# EAGLE board 519_jetson_nano1014 (EAGLE 9.6.0)
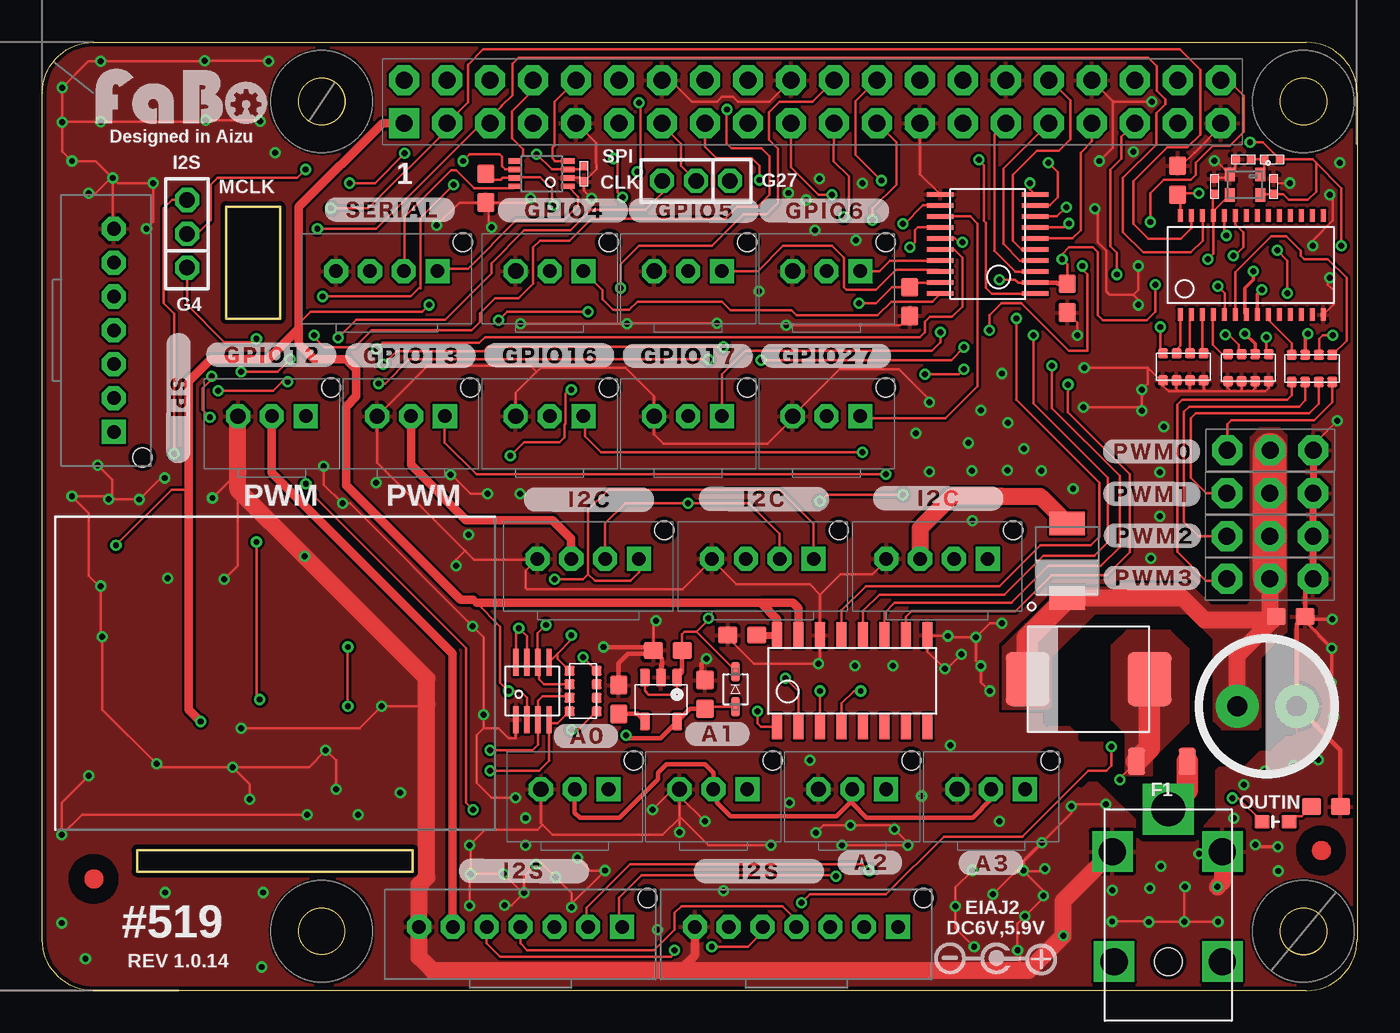
[diagram p2: board, top side]
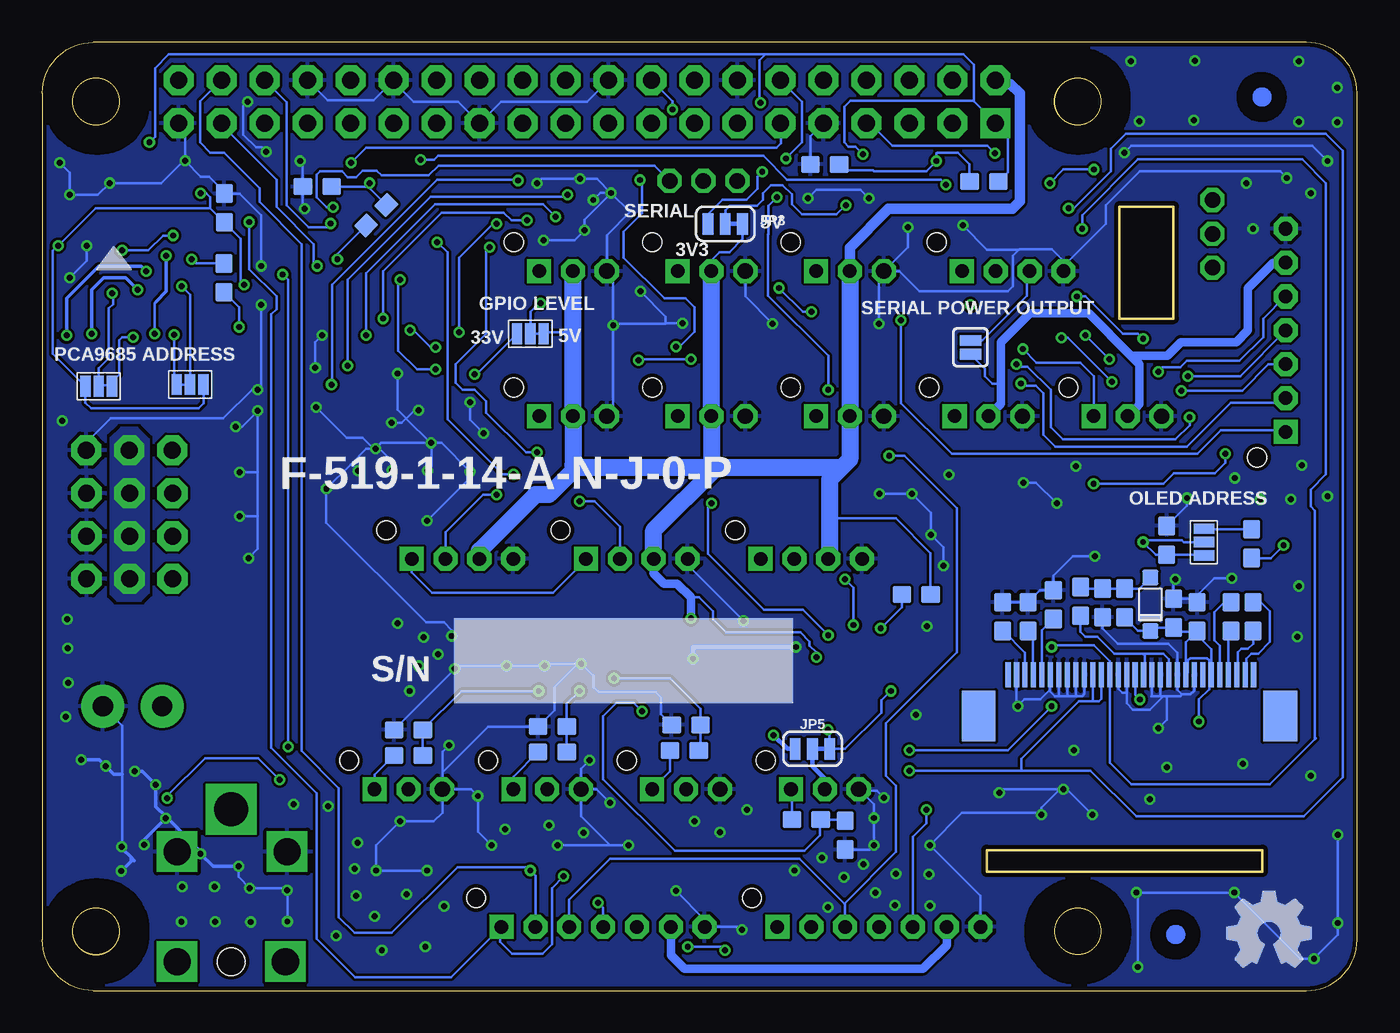
[diagram p3: board, bottom side, seen from below]

Size 77.68 x 56 mm. Coordinates in mm from the lower left corner, seen from the top.
Outline: 5.6,7.03 21.88,7.03 21.88,8.3 5.6,8.3 5.6,7.03
Outline: 10.85,46.29 14.05,46.29 14.05,39.69 10.85,39.69 10.85,46.29
Outline: circle at 16.51,52.51 radius 1.38
Outline: circle at 74.5,52.5 radius 1.38
Outline: circle at 16.5,3.5 radius 1.38
Outline: circle at 74.5,3.49 radius 1.38
Copper layers (1*16): Top 0.035mm / dielectric 1.6mm / Bottom 0.035mm
Design rules "PCBway": minimum track width 6mil, minimum drill 12mil, track to track 6mil, track to pad 6mil, pad to pad 6mil, via to via 6mil, smd to smd 6mil, copper to edge 10mil, drill to drill 10mil, minimum pad ring 10mil, minimum via ring 6mil, stop-mask expansion 2mil, vias tented up to drill 100mil, thermal gap 8mil
tKeepout: area 1,9.7 to 26.4,27.6
bKeepout: area 3.5,7.7 to 24.2,20; area 68.5,45.3 to 72.3,48.9
tRestrict: area 13.5,49.5 to 19.5,55.5; area 71.5,49.5 to 77.5,55.5; area 71.5,0.5 to 77.4,6.5; area 13.5,0.5 to 19.5,6.5; 135 lines
bRestrict: area 13.5,49.5 to 19.5,55.5; area 71.5,49.5 to 77.5,55.5; area 13.5,0.5 to 19.5,6.5; area 71.5,0.5 to 77.5,6.5; 8 lines

## Footprints (pad centres in the part's own frame; a part is rotated, then mirrored left to right if it is on the bottom)
FABO_BRICK_3PIN_B03B-PASK-1 = drill 0.9 pad 1.422 octagon: GND -2,0 | drill 0.8 pad 1.422 square: I/O 2,0 | drill 0.8 pad 1.422 octagon: VCC 0,0 | hole 1.1: 3.5,1.7
0603 = smd 1.1 x 1: 1 -0.85,0; 2 0.85,0
0402 = smd 0.5 x 0.5: P$1 -0.46,0; P$2 0.46,0
E7(PANA) = drill 1.2 pad 2.54: MINUS 1.75,0; PLUS -1.75,0
1N4148W = smd 0.9 x 0.95: ANODE 0,0; CATHODE 3.15,0
SOD-323 = smd 1.14 x 0.52: A 1.04,0; C -1.04,0
1206 = smd 1 x 1.6: 1 -1.5,0; 2 1.5,0
FABO_BRICK_I2C_B04B-PASK-1 = drill 0.8 pad 1.422 octagon: GND -3,0; SDA 1,0; VCC -1,0 | drill 0.8 pad 1.422 square: SCL 3,0 | hole 1.1: 4.5,1.7
SPI-B07B-PASK-1 = drill 0.8 pad 1.422 octagon: 1 -6,1.27; 2 -4,1.27; 3 -2,1.27; 4 0,1.27; 5 2,1.27; 6 4,1.27 | drill 0.8 pad 1.422 square: 7 6,1.27 | hole 1.1: 7.5,2.97
8PIN-SSOP = smd 0.3 x 1.6: 1 -0.975,-1.7; 2 -0.325,-1.7; 3 0.325,-1.7; 4 0.975,-1.7; 5 0.975,1.7; 6 0.325,1.7; 7 -0.325,1.7; 8 -0.975,1.7
MICROCHIP-MCP3008 = smd 0.6 x 1.5: 1 -4.445,-2.7; 2 -3.175,-2.7; 3 -1.905,-2.7; 4 -0.635,-2.7; 5 0.635,-2.7; 6 1.905,-2.7; 7 3.175,-2.7; 8 4.445,-2.7; 9 4.445,2.7; 10 3.175,2.7; 11 1.905,2.7; 12 0.635,2.7; 13 -0.635,2.7; 14 -1.905,2.7; 15 -3.175,2.7; 16 -4.445,2.7
JUMPERS_JP2-2MM = drill 0.914 octagon: 1 -2,0; 2 0,0; 3 2,0
SMT-JUMPER_2_NC_PASTE_SILK = smd 0.635 x 1.27: 1 -0.406,0; 2 0.406,0
SMT-JUMPER_3_1-NC_TRACE_SILK = smd 0.635 x 1.27: 1 -1.016,0; 2 0,0; 3 1.016,0
0603' = smd 0.9 x 0.8: ANODE -0.8,0; CATHODE 0.8,0
M04339A0 = drill 1.6 square: GND -3.2,-6.5; GNDBREAK 3.3,-6.5; ND1 -3.2,0; ND2 3.2,0 | drill 2 square: VCC 0,-9 | hole 1.6: 0,0
FABO_BRICK_3PIN_HEADER = drill 1 pad 1.778 octagon: GND -2.54,0; I/O 2.54,0; VCC 0,0
EXBV8V = smd 0.6 x 0.6: 1 -1.2,-0.8; 2 -0.4,-0.8; 3 0.4,-0.8; 4 1.2,-0.8; 5 1.2,0.8; 6 0.4,0.8; 7 -0.4,0.8; 8 -1.2,0.8
FABO_BRICK_SERIAL_B04B-PASK-1 = drill 0.8 pad 1.422 octagon: GND -3,0; TX 1,0; VCC -1,0 | drill 0.8 pad 1.422 square: RX 3,0 | hole 1.1: 4.5,1.7
SMD-JUMPER-3 = smd 0.61 x 1.219: 1 -0.787,0; 2 0,0; 3 0.787,0
ER-CON30HT-1 = smd 0.3 x 1.5 bottom: 1 7,-0.23; 2 6.5,-0.23; 3 6,-0.23; 4 5.5,-0.23; 5 5,-0.23; 6 4.5,-0.23; 7 4,-0.23; 8 3.5,-0.23; 9 3,-0.23; 10 2.5,-0.23; 11 2,-0.23; 12 1.5,-0.23; 13 1,-0.23; 14 0.5,-0.23; 15 0,-0.23; 16 -0.5,-0.23; 17 -1,-0.23; 18 -1.5,-0.23; 19 -2,-0.23; 20 -2.5,-0.23; 21 -3,-0.23; 22 -3.5,-0.23; 23 -4,-0.23; 24 -4.5,-0.23; 25 -5,-0.23; 26 -5.5,-0.23; 27 -6,-0.23; 28 -6.5,-0.23; 29 -7,-0.23; 30 -7.5,-0.23 | smd 2 x 3 bottom: 31 -9.07,-2.67; 32 8.74,-2.67
R-PUSON-N20 = smd 0.25 x 1.55: 1 -2.925,-2.8; 2 -2.275,-2.8; 3 -1.625,-2.8; 4 -0.975,-2.8; 5 -0.325,-2.8; 6 0.325,-2.8; 7 0.975,-2.8; 8 1.625,-2.8; 9 2.275,-2.8; 10 2.925,-2.8; 11 2.925,2.8; 12 2.275,2.8; 13 1.625,2.8; 14 0.975,2.8; 15 0.325,2.8; 16 -0.325,2.8; 17 -0.975,2.8; 18 -1.625,2.8; 19 -2.275,2.8; 20 -2.925,2.8
SOT-23-5 = smd 0.6 x 1.05: 1 -0.95,-1.3; 2 0,-1.3; 3 0.95,-1.3; 4 0.95,1.3; 5 -0.95,1.3
JETSON_NANO_COMPA = drill 1 pad 1.778 square: 1 -17.78,15.24 | drill 1 pad 1.778 octagon: 2 -17.78,17.78; 3 -15.24,15.24; 4 -15.24,17.78; 5 -12.7,15.24; 6 -12.7,17.78; 7 -10.16,15.24; 8 -10.16,17.78; 9 -7.62,15.24; 10 -7.62,17.78; 11 -5.08,15.24; 12 -5.08,17.78; 13 -2.54,15.24; 14 -2.54,17.78; 15 0,15.24; 16 0,17.78; 17 2.54,15.24; 18 2.54,17.78; 19 5.08,15.24; 20 5.08,17.78; 21 7.62,15.24; 22 7.62,17.78; 23 10.16,15.24; 24 10.16,17.78; 25 12.7,15.24; 26 12.7,17.78; 27 15.24,15.24; 28 15.24,17.78; 29 17.78,15.24; 30 17.78,17.78; 31 20.32,15.24; 32 20.32,17.78; 33 22.86,15.24; 34 22.86,17.78; 35 25.4,15.24; 36 25.4,17.78; 37 27.94,15.24; 38 27.94,17.78; 39 30.48,15.24; 40 30.48,17.78
VSSOP8 = smd 0.3 x 0.8: 1 -0.75,-1.55; 2 -0.25,-1.55; 3 0.25,-1.55; 4 0.75,-1.55; 5 0.75,1.55; 6 0.25,1.55; 7 -0.25,1.55; 8 -0.75,1.55
PCA9685 = smd 0.3 x 0.75: 1 -4.15,-2.93; 2 -3.5,-2.93; 3 -2.85,-2.93; 4 -2.2,-2.93; 5 -1.55,-2.93; 6 -0.9,-2.93; 7 -0.25,-2.93; 8 0.4,-2.93; 9 1.05,-2.93; 10 1.7,-2.93; 11 2.35,-2.93; 12 3,-2.93; 13 3.65,-2.93; 14 4.3,-2.93; 15 4.3,2.92; 16 3.65,2.92; 17 3,2.92; 18 2.35,2.92; 19 1.7,2.92; 20 1.05,2.92; 21 0.4,2.92; 22 -0.25,2.92; 23 -0.9,2.92; 24 -1.55,2.92; 25 -2.2,2.92; 26 -2.85,2.92; 27 -3.5,2.92; 28 -4.15,2.92
DO-214AB = smd 2.6 x 3.2: ANODE 3.6,0; CATHODE -3.6,0
KC2016Z = smd 0.6 x 0.8: #1 -0.9,-0.6; #2 0.9,-0.6; #3 0.9,0.6; #4 -0.9,0.6
SOD-128 = smd 1.4 x 2.1: A -2.2,0; K 2.2,0

## Placement (x,y rotation side)
A0  [FABO_BRICK_3PIN_B03B-PASK-1]  31.45,11.89 0 top
A1  [FABO_BRICK_3PIN_B03B-PASK-1]  39.65,11.89 0 top
A2  [FABO_BRICK_3PIN_B03B-PASK-1]  47.85,11.89 0 top
A3  [FABO_BRICK_3PIN_B03B-PASK-1]  56.05,11.89 0 top
C1  10uF  [0603]  20.95,22.09 270 bottom
C2  10uF  [0603]  19.45,22.09 270 bottom
C3  10uF  [0603]  15.05,22.89 90 bottom
C4  1uF  [0603]  7.45,22.09 270 bottom
C5  1uF  [0603]  6.15,22.09 90 bottom
C6  1uF  [0603]  9.45,22.09 270 bottom
C7  0.1uF  [0603]  60.55,40.89 270 top
C8  0.1uF  [0603]  67.07,47.86 270 top
C9  0.1uF  [0603]  41.35,20.99 0 top
C10  0.1uF  [0603]  51.25,40.69 270 top
C11  1uF  [0603]  36.95,20.09 0 top
C12  0.1uF  [0603]  73.75,22.09 0 top
C13  0.1uF  [0402]  72.75,47.49 270 top
C14  20pF  [0402]  69.25,47.49 270 top
C15  1uF  [0603]  10.85,22.29 270 bottom
C16  0.01uF  [0603]  34.05,17.19 270 top
C17  4.7uF  [0603]  39.15,17.49 270 top
C18  0.1uF  [0402]  32,48.24 270 top
C19  0.1uF  [0603]  26.2,47.39 270 top
C20  10uF  [0603]  66.93,46.22 90 bottom
C100  OSCON  [E7(PANA)]  72.35,16.79 0 top
D1  1N4148  [1N4148W]  12.22,24.39 270 bottom
D2  1N4148WS  [SOD-323]  40.95,17.79 270 top
F1  1206L150/12SLYR  [1206]  66.14,13.53 180 top
GPIO4  [FABO_BRICK_3PIN_B03B-PASK-1]  29.97,42.49 0 top
GPIO5  [FABO_BRICK_3PIN_B03B-PASK-1]  38.15,42.49 0 top
GPIO6  [FABO_BRICK_3PIN_B03B-PASK-1]  46.33,42.49 0 top
GPIO12  [FABO_BRICK_3PIN_B03B-PASK-1]  13.56,33.92 0 top
GPIO13  [FABO_BRICK_3PIN_B03B-PASK-1]  21.78,33.92 0 top
GPIO16  [FABO_BRICK_3PIN_B03B-PASK-1]  29.97,33.92 0 top
GPIO17  [FABO_BRICK_3PIN_B03B-PASK-1]  38.15,33.92 0 top
GPIO27  [FABO_BRICK_3PIN_B03B-PASK-1]  46.33,33.92 0 top
I2C0  [FABO_BRICK_I2C_B04B-PASK-1]  32.25,25.49 0 top
I2C1  [FABO_BRICK_I2C_B04B-PASK-1]  42.56,25.49 0 top
I2C2  [FABO_BRICK_I2C_B04B-PASK-1]  52.86,25.49 0 top
I2S0  FABO-I2S-7PIN  [SPI-B07B-PASK-1]  28.25,2.49 0 top
I2S1  FABO-I2S-7PIN  [SPI-B07B-PASK-1]  44.55,2.49 0 top
IC1  [8PIN-SSOP]  28.95,17.69 0 top
IC3  [MICROCHIP-MCP3008]  47.85,18.29 0 top
JP1  JUMPERS_JP2-2MM  [JUMPERS_JP2-2MM]  8.55,44.69 90 top
JP2  JUMPER-SMT_2_NC_PASTE_SILK  [SMT-JUMPER_2_NC_PASTE_SILK]  22.85,37.99 270 bottom
JP3  JUMPER-SMT_3_1-NC_TRACE_SILK  [SMT-JUMPER_3_1-NC_TRACE_SILK]  37.33,45.28 0 bottom
JP4  JUMPERS_JP2-2MM  [JUMPERS_JP2-2MM]  38.62,47.82 180 top
JP5  JUMPER-SMT_3_1-NC_TRACE_SILK  [SMT-JUMPER_3_1-NC_TRACE_SILK]  32.18,14.28 0 bottom
LED1  [0603']  72.86,9.97 0 top
LOGO1  [LOGO_FABO_M]  8.23,50.82 0 top
P2  [M04339A0]  66.52,1.71 180 top
PWM0  [FABO_BRICK_3PIN_HEADER]  72.54,31.91 180 top
PWM1  [FABO_BRICK_3PIN_HEADER]  72.53,29.37 180 top
PWM2  [FABO_BRICK_3PIN_HEADER]  72.53,26.83 180 top
PWM3  [FABO_BRICK_3PIN_HEADER]  72.53,24.31 180 top
R1  10k  [EXBV8V]  67.41,36.83 0 top
R2  10k  [EXBV8V]  71.25,36.79 0 top
R3  220  [EXBV8V]  75.01,36.74 180 top
R4  0  [0603]  32.55,10.11 0 bottom
R5  1K  [0603]  75.84,10.87 0 top
R6  4.7K  [0603]  11.25,26.59 270 bottom
R7  0  [0402]  72.65,49.09 0 top
R8  10K  [EXBV8V]  31.95,17.69 270 top
R9  200K  [0603]  26.05,23.39 0 bottom
R10  NC  [0603]  30.25,9.18 90 bottom
R11  0  [0603]  39.75,14.19 0 bottom
R12  0  [0603]  47.55,14.09 0 bottom
R13  0  [0603]  56.05,13.89 0 bottom
R14  NC  [0603]  39.65,15.69 0 bottom
R15  NC  [0603]  47.55,15.59 0 bottom
R16  NC  [0603]  56.05,15.39 0 bottom
R17  20K  [0603]  22.05,47.79 0 bottom
R18  NC  [0603]  66.95,42.09 90 bottom
R19  390K  [0603]  17.95,22.79 270 bottom
R20  4.7K  [0603]  6.25,26.39 270 bottom
R21  1M  [0603]  31.45,48.79 0 bottom
R22  DNP  [0402]  70.95,49.09 0 top
R23  20K  [0603]  57.95,45.79 225 bottom
R24  1M  [0603]  61.44,47.48 0 bottom
R25  100  [0603]  16.35,22.99 90 bottom
R26  10K  [0603]  13.75,22.89 270 bottom
SERIAL  [FABO_BRICK_SERIAL_B04B-PASK-1]  20.35,42.49 0 top
SJ2  [SMD-JUMPER-3]  74.35,35.69 0 bottom
SJ3  [SMD-JUMPER-3]  48.85,38.79 0 bottom
SJ5  [SMD-JUMPER-3]  68.95,35.79 180 bottom
SJ6  [SMD-JUMPER-3]  9.05,26.49 270 bottom
SPI1  FABO-SPI-7PIN  [SPI-B07B-PASK-1]  2.95,38.99 270 top
U1  [ER-CON30HT-1]  13.62,18.88 0 top
U2  TXB0108  [R-PUSON-N20]  55.85,44.09 90 top
U7  LP2985-50  [SOT-23-5]  36.55,17.19 180 top
U$2  JETSON_NANOJETSON_NANO_COMPA  [JETSON_NANO_COMPA]  39.15,35.99 0 top
U$3  [MARK_POINT_3MM]  3.05,6.59 0 top
U$4  [MARK_POINT_3MM]  75.57,8.27 0 top
U$5  [MARK_POINT_3MM]  10.72,3.31 0 bottom
U$6  [MARK_POINT_3MM]  5.62,52.77 0 bottom
U$7  TXB0102  [VSSOP8]  29.5,48.24 90 top
U$8  LOGO_OSHW-M_BOTTOM  [LOGO_OSHW_M_BOTTOM]  5.2,3.4 0 top
U$9  PCA9685  [PCA9685]  71.38,42.85 0 top
U$10  S3D  [DO-214AB]  61.81,18.39 0 top
U$11  KC2016Z  [KC2016Z]  71.05,47.59 180 top
U$12  PMEG10030ELP  [SOD-128]  60.55,25.39 270 top

## Tracks (layer width: path | path; a pad name or v marks a point on that pad's centre or on a via)
3V3  (via drill 0.35)
  Top 0.152: C8.2 67.07,46.94 | v4.35,26.29 7.65,29.59 8.65,29.59 | v22.85,40.49 22.45,40.09 15.85,40.09 15.15,39.39 | R8.6 R8.5 31.66,15.4 v31.27,15.4 | IC1.2 28.65,16.02 28.65,17.29 28.25,17.69 v27.55,17.69 27.05,18.19 27.05,21.49 25.65,22.89 25.45,23.09 | U$11.#4 71.99,47.03 C13.P$2 73.31,47.03 73.65,46.69 74.75,46.69 75.25,47.19 75.25,48.89 | U$9.28 67.22,45.78 67.22,46.86 C8.2 | v71.35,50.09 72.11,50.09 R7.P$2 75.05,49.09 75.25,48.89 | C7.1 60.55,42.89 v60.25,43.19 60.25,43.49 60.65,43.89 62.05,43.89 62.35,43.59 62.35,39.89 62.65,39.59 65.25,39.59 65.75,40.09 v65.75,41.69 | v68.32,47.09 67.16,47.09 C8.2 | 75.25,48.89 76.75,47.39 v76.75,43.99 | C18.P$1 31.79,48.49 U$7.3 30.1,48.49 v29.2,49.39 | 35.3,52.49 v35.25,52.44 35.33,52.36 35.33,48.53 | v52.15,36.39 54.15,36.39 v54.45,36.69 | v56.55,41.99 57.45,41.99 57.65,41.79 58.63,41.79 U2.2 | v35.15,48.35 35.33,48.53 | 35.33,48.53
  Top 0.254: C7.1 60,41.74 59.95,41.79 58.68,41.79 U2.2
  Top 0.406: C9.2 IC3.16
  Top 0.508: U$2.1 20.09,51.23 15.15,46.29 15.15,39.39 15.15,39.09 | 15.15,39.09 15.15,38.19 16.05,37.29 17.95,37.29 18.55,36.69 18.55,35.09 17.95,34.49 17.95,29.84 24.7,23.09 25.45,23.09 | 15.15,39.09 13.35,37.29 9.95,37.29 8.65,35.99 8.65,29.59 8.65,16.59 v9.35,15.89 | 25.65,22.89 42.45,22.89 | 42.45,22.89 43.41,21.94 IC3.16 | IC3.15 44.68,22.57 44.35,22.89 42.45,22.89
  Bottom 0.152: U1.25 8.62,20.16 9.45,20.99 9.45,21.19 | 9.45,21.19 C6.2 10.12,20.57 U1.22 10,18.77 10,19.5 9.87,19.63 8.88,19.63 8.74,19.5 8.74,17.81 9.35,17.2 v9.35,15.89 | 9.45,21.19 10.6,21.19 C15.2 12.02,21.44 D1.CATHODE 12.95,21.24 R26.2 | 34.95,55.29 70.2,55.29 71.02,54.47 71.02,50.42 v71.35,50.09 | 34.95,55.29 23.25,55.29 22.65,54.69 22.65,52.51 | 22.65,52.51 U$2.1 20.65,50.51 20.65,48.34 R17.2 | R20.2 5.1,25.54 v4.35,26.29 | v22.85,40.49 22.95,40.39 | R23.2 60.25,43.49 v60.25,43.19 | v65.75,41.69 65.95,41.89 65.95,42.66 65.96,42.66 65.96,44.4 C20.1 67.77,46.21 | SJ5.1 68.15,35.78 68.15,34.69 68.45,34.39 74.8,34.39 75.14,34.73 SJ2.1 77.05,37.6 77.05,43.69 v76.75,43.99 74.53,46.21 67.77,46.21 | v29.2,49.39 29.65,49.84 30.05,49.84 30.3,50.09 30.3,52.19 29.95,52.54 22.68,52.54 22.65,52.51 | v35.25,52.44 35.3,52.49 35.3,54.94 34.95,55.29 | SJ3.1 52.09,36.33 v52.15,36.39 | v54.45,36.69 55.55,36.69 56.65,37.79 56.65,41.89 v56.55,41.99 | v35.15,48.35 35.44,48.06 35.44,47.35 36.08,46.71 37.49,46.71 38.35,45.85 JP3.1 | v31.27,15.4 31.16,15.29 JP5.3 30.25,14.28 28.12,16.41 28.12,17.15 27.58,17.69 v27.55,17.69 | 67.77,46.21 67.77,46.85 68.01,47.09 v68.32,47.09
5V  (via drill 0.35)
  Top 0.152: U2.19 51.77,41.82 51.5,41.54 C10.1 50.2,41.54 49.25,40.59 v48.25,40.59 | D2.C 40.95,18.89 38.65,21.19 | 38.65,21.19 37.95,21.19 37.8,21.04 C11.2 | R8.7 R8.8 v31.95,19.69 | 38.65,21.19 39.35,21.89 v39.35,21.99 | 56.45,29.49 56.75,29.19 | U7.3 35.6,17.7 35.82,17.48 37.32,17.48 37.5,17.66 U7.1
  Top 0.254: U7.1 37.8,18.79 C11.2
  Top 0.508: I2S0.2 24.25,19.89 13.56,30.58 GPIO12.VCC | GPIO13.VCC 21.78,31.06 25.05,27.79 30.15,27.79 31.25,26.69 I2C0.VCC
  Top 1.016: U$12.A 58.95,29.19 56.75,29.19 53.75,29.19 51.86,27.3 I2C2.VCC
  Bottom 0.152: v31.95,19.69 31.95,19.97 32.35,20.37 32.35,20.61 32.89,21.15 37.28,21.15 38.05,21.92 38.05,22.39 38.88,23.22 39.35,23.22 | R9.2 25.2,25.84 27.25,27.89 31.15,27.89 | 46.6,42.76 GPIO6.VCC | JP2.2 22,36.73 22,36.29 21.55,35.84 21.05,35.84 | v48.25,40.59 48.35,40.59 48.85,40.09 SJ3.2 SJ3.3 47.96,38.89 46.33,38.89 | JP3.3 36.31,44.39 37.09,43.61 37.67,43.61 38.15,43.13 GPIO5.VCC
  Bottom 0.254: 21.16,36.38 21.05,36.49
  Bottom 0.5: 13.06,34.42 GPIO12.VCC | 21.05,34.68 21.05,35.84 21.05,36.49 21.05,38.29 19.35,39.99 15.85,39.99 | v39.35,21.99 39.35,23.22
  Bottom 0.508: 15.85,39.99 13.36,37.5 | 13.36,37.5 12.86,37 12.86,34.62 13.06,34.42 | 13.36,37.5 11.22,37.5 10.43,38.29 7.15,38.29 6.45,38.99 6.45,41.49 4.95,42.99 SPI1.2 | I2S0.2 24.25,2.69 25.65,1.29 39.75,1.29 40.55,2.09 I2S1.2 | 21.05,34.68 21.05,34.65 GPIO13.VCC | 39.35,23.22 40.17,24.04 40.95,24.04 41.56,24.65 I2C1.VCC
  Bottom 0.61: U$2.2 21.13,53.53 20.48,53.53 19.93,52.98 19.93,46.61 20.38,46.16 27.68,46.16 29.97,43.87 GPIO4.VCC
  Bottom 1: I2C0.VCC 31.15,25.59 31.15,27.89 | I2C1.VCC 41.56,27.18 37.86,30.88
  Bottom 1.016: 37.86,30.88 46.16,30.88 | 46.16,30.88 47.75,29.29 48.55,29.29 51.86,25.98 I2C2.VCC | 30.46,30.88 29.97,31.37 GPIO16.VCC GPIO4.VCC 29.9,42.56 | 30.46,30.88 37.86,30.88 | 31.15,27.89 31.15,30.19 30.46,30.88 | 37.86,30.88 38.15,31.17 GPIO17.VCC GPIO5.VCC | 46.16,30.88 46.33,31.05 GPIO27.VCC 46.33,38.89 GPIO6.VCC
+5  (via drill 0.35)
  Top 0.152: C17.2 39.26,16.75 D2.A
  Top 0.254: U7.5 38.25,16.64 C17.2 38.95,16.44 | 37.5,15.84 U7.5 | U7.5 36.52,14.91 34.66,14.91 v34.48,15.09
  Bottom 0.254: v34.48,15.09 33.67,14.28 JP5.1
AVDD
  Top 0.254: A0.VCC 31.45,10.51 31.76,10.2 34.09,10.2 36.38,12.49 36.38,12.87 36.88,13.37 39.15,13.37 39.65,12.87 A1.VCC 39.85,11.69 39.85,11.09 40.65,10.29 46.91,10.29 47.85,11.23 A2.VCC 47.85,11.07 48.7,10.22 54.97,10.22 56.05,11.3 A3.VCC
  Bottom 0.254: JP5.2 32.18,13.25 31.45,12.52 A0.VCC
CH0
  Bottom 0.152: R4.1 33.4,11.84 A0.I/O
CH1
  Bottom 0.152: A1.I/O 40.6,12.94 R11.1
CH2
  Bottom 0.152: R12.1 49.85,12.64 A2.I/O
CH3
  Bottom 0.152: R13.1 58.05,12.74 A3.I/O
GND  (via drill 0.35)
  Top 0.152: R2.1 70.05,35.59 70.25,35.39 | 70.25,35.39 70.75,35.39 | 70.75,35.39 70.85,35.49 R2.2 | R2.3 71.65,35.59 71.45,35.39 | 71.45,35.39 70.75,35.39 | R1.4 68.61,35.53 68.75,35.39 | 68.75,35.39 70.25,35.39 | R1.1 66.21,35.89 | 66.21,35.89 66.21,35.73 66.55,35.39 67.15,35.39 | 67.15,35.39 67.75,35.39 | R1.3 67.81,35.45 67.75,35.39 | R1.2 67.01,35.53 67.15,35.39 | U$9.14 76.28,40.52 76.28,41.36 75.95,41.69 75.95,41.99 v76.05,42.09 | R2.4 72.45,35.59 72.25,35.39 71.45,35.39 | 22.71,16.89 22.61,16.79 v20.05,16.79 18.75,15.49 v11.75,15.49 | v10.75,24.29 11.55,25.09 11.55,29.59 | v10.05,29.09 11.55,30.59 | C11.1 36.1,21.7 v36.25,21.85 | C14.P$1 69.29,47.99 69.95,47.99 U$11.#2 | U$11.#2 70.49,48.53 R22.P$1 | U$2.25 51.85,48.22 U2.11 | U$11.#2 69.34,49 v69.24,49 | C8.1 67.28,48.71 68.06,49.48 68.08,49.48 69.63,51.04 U$2.39 | v62.45,48.99 63.24,49.79 63.24,50.36 63.25,50.36 63.25,52.53 | U$2.34 63.25,52.53 | 29.55,9.79 29.45,9.89 A0.GND 29.5,11.89 | 29.55,9.79 30.15,9.19 36.65,9.19 37.64,10.18 | 37.65,10.29 37.65,10.19 37.64,10.18 | 37.65,10.29 37.65,11.49 | 37.65,11.49 37.65,11.8 | 37.65,11.8 A1.GND | v43.05,8.59 39.35,8.59 37.65,10.29 | v25.25,8.59 25.3,8.64 | 25.3,8.64 26.15,9.49 29.25,9.49 29.55,9.79 | IC3.14 45.95,20.69 | 45.95,20.69 45.95,19.39 45.9,19.34 | 45.9,19.34 v45.85,19.29 42.05,19.29 40.5,20.84 C9.1 | 45.95,23.39 47.15,24.59 49.03,24.59 49.86,25.42 I2C2.GND | 45.95,20.69 45.95,20.7 45.95,23.39 | IC3.9 52.15,20.85 | 46.05,19.19 45.9,19.34 | 45.95,23.39 45.35,23.99 41,23.99 39.56,25.43 | 29.2,25.44 28.55,24.79 28.55,23.79 28.65,23.69 37.82,23.69 39.56,25.43 | 29.2,25.44 I2C0.GND | 29.2,25.44 25.5,25.44 24.97,25.97
  Top 0.152: 24.97,25.97 19.78,31.16 GPIO13.GND 22.72,36.86 22.72,36.89 28.85,36.89 29.2,36.54 | 29.2,36.54 27.97,35.31 GPIO16.GND | 29.2,36.54 29.45,36.79 34.45,36.79 36.15,35.09 GPIO17.GND 36.15,32.84 36.7,32.29 42.85,32.29 44.33,33.77 GPIO27.GND 47.1,36.69 50.6,36.69 52.4,34.89 v52.4,34.74 | v4.15,47.99 4.15,45.06 SPI1.1 | U$2.14 37.11,53.77 38.39,52.49 39.85,52.49 40.15,52.79 40.79,52.79 41.09,52.49 42.95,52.49 U$2.20 | v62.18,46.18 62.35,46.01 62.35,44.19 62.85,43.69 62.85,41.29 63.05,41.09 64.45,41.09 | v64.75,42.79 64.75,41.39 64.45,41.09 | C10.2 50.7,39.29 v43.95,39.29 | v28.25,39.39 v34.55,39.39 v34.56,39.4 v39.87,39.4 | C7.2 61.15,39.44 v61.15,38.69 | v61.55,36.79 65.31,36.79 | 65.31,36.79 66.21,35.89 | 65.31,36.79 65.31,35.85 v64.95,35.49 v64.95,34.24 64.75,34.44 v61.5,34.44 | 64.45,41.09 64.75,40.79 v64.75,40.49 | v73.69,47.69 73.01,47.69 C13.P$1 | v75.05,43.99 75.05,44.29 76.25,45.49 76.25,46.79 v76.05,46.99 | v37.64,9.35 37.64,10.18 | v36.05,10.69 37.16,11.8 37.65,11.8 | v39.15,9.99 37.65,11.49 | v54.95,7.09 53.95,6.09 v53.95,4.99 53.95,3.69 v55.05,2.59 | v56.15,5.69 57.55,7.09 v57.95,7.09 58,7.04 | 58,7.04 59.15,5.89 v59.15,5.59 59.15,5.49 v58.05,4.39 57.62,3.96 v57.62,2.39 57.75,2.26 57.75,1.19 | IC1.1 27.95,15.97 27.95,14.89 27.55,14.89 26.95,15.49 26.05,15.49 | 26.05,15.49 25.66,15.09 25.66,12.29 26.55,11.39 v27.95,11.39 | v17.35,11.89 17.35,13.59 v16.75,14.19 15.75,13.19 v11.25,13.19 | v11.25,13.19 6.95,13.19 v6.75,13.39 3.55,16.59 v3.55,20.89 3.45,20.99 v3.45,23.89 3.35,23.89 2.75,24.49 2.75,28.19 v1.75,29.19 3.74,29.19 v3.92,29.01 4.12,29.01 | v15.65,10.39 2.35,10.39 v1.15,9.19 1.15,11.09 v2.75,12.69
  Top 0.152: 4.1,48.04 3.15,48.99 v1.75,48.99 1.17,49.57 v1.17,51.27 | 4.1,48.04 v4.15,47.99 | v2.75,47.09 3.15,47.09 4.1,48.04 | v4.15,47.99 4.45,47.69 v6.55,47.69 6.55,45.39 v6.15,44.99 | v11.25,13.19 12.25,12.19 v12.25,11.29 | v47.25,8.59 51.02,8.59 | 51.02,8.59 v51.15,8.59 | IC3.9 52.3,20.02 v53.32,19 53.44,19 v54.31,19.87 | IC3.9 52.34,20.94 53.4,20.94 | 53.4,20.94 v53.5,20.94 | v65.54,52.49 63.29,52.49 63.25,52.53 | I2C1.GND 39.56,25.43 | 67.75,35.39 68.75,35.39 | PWM0.GND 75.08,32.22 v76.5,33.64 | U$7.2 31.79,47.99 C18.P$2 | 26.35,46.54 C19.2 24.65,46.54 v23.3,45.19 | 26.35,46.54 28.6,46.54 v28.85,46.79 | v32.45,46.79 32,47.24 C18.P$2 | U$2.9 32.7,50.06 32.7,48.82 32.73,48.8 32.73,48.51 C18.P$2 | v26.55,45.09 26.35,45.29 26.35,46.54 | v25.24,5.01 25.24,6.8 v25.3,6.86 | v25.3,6.86 25.3,8.64 | v25.3,6.86 25.34,6.9 v27.25,6.9 28.38,5.77 v28.45,5.77 | v28.45,5.77 27.71,5.03 v27.31,5.03 | v28.45,5.77 28.45,6.75 v29.17,7.47 29.54,7.47 v30.31,6.7 31.27,5.74 v31.27,4.92 31.27,5.12 v33.24,7.09 32.38,7.09 v31.63,7.84 | v45.71,9.33 46.14,9.76 v47.74,9.76 50.11,9.76 v50.34,9.53 51.02,8.85 51.02,8.59 | v1.17,51.27 v1.17,53.32 v1.18,53.33 2.72,54.87 3.43,54.87 v3.45,54.89 9.57,54.89 v9.6,54.92 13.35,54.92 v13.38,54.89 | 4.12,29.01 v5.71,29.01 v5.72,29 6.99,30.27 v7.22,30.27 | v3.27,31.02 4.12,30.17 4.12,29.01 | v16.63,30.96 16.63,29.88 v17.74,28.77 18.17,28.77 v25.43,21.51 26.08,20.86 v26.08,16.28 26.08,15.52 26.05,15.49 | v24.12,30.47 24.17,30.47 25.31,29.33 v26.3,29.33 | v24.45,25.08 24.45,25.45 24.97,25.97 | v1.17,51.27 1.21,51.31 v3.46,51.31 9.56,51.31 v9.66,51.41 12.81,51.41 v12.87,51.35
  Top 0.152: v59.06,8.74 60.8,10.48 v60.8,10.89 60.91,11 v62.83,11 | v63.2,4.08 65.35,4.08 v65.38,4.05 v67.46,4.05 v67.47,4.06 | v67.47,4.06 67.47,6.08 v67.51,6.12 | v67.47,4.06 v69.46,4.06 | v55.16,20.87 55.16,19.47 v55.46,19.17 55.46,18.2 v55.97,17.69 | v55.16,20.87 55.98,21.69 v56.68,21.69 | v55.16,20.87 53.47,20.87 53.4,20.94 | v59.22,7.2 59.06,7.04 58,7.04
  Top 0.2: v76.22,21.93 74.76,21.93 C12.2 74.6,21.81 v76.19,20.22 76.19,18.23 v76.14,18.18 76.14,16.33 v76.3,16.17 | v71.65,8.61 71.77,8.49 v72.99,8.49 | v57.95,7.09 57.95,7.63 v59.06,8.74 59.2,8.74
  Top 0.254: R5.2 76.69,14.2 C100.MINUS 74.1,21.59 C12.2 74.6,23.84 PWM3.GND | U7.2 36.55,19.19 36.6,19.14 36.6,19.59 C11.1 | C16.1 34.05,19.34 34.6,19.89 35.74,19.89 35.94,20.09 C11.1 | C17.1 38.95,18.54 38.95,19.29 v39.25,19.59 | v33.15,20.29 35.9,20.29 C11.1
  Top 0.406: PWM0.GND PWM1.GND PWM2.GND PWM3.GND
  Top 0.508: I2S1.1 38.55,2.09 37.65,1.19
  Top 1: 37.65,1.19 23.05,1.19 22.25,1.99 I2S0.1 22.25,6.23 22.71,6.69 22.71,16.89 22.71,18.43 v15.5,25.64 11.55,29.59 11.55,30.59 GPIO12.GND
  Top 1.016: 37.65,1.19 57.75,1.19 58.27,1.19 v60.31,3.23 60.31,5.3 P2.GNDBREAK | P2.GND 69.72,6.42 v69.42,6.12
  Bottom 0.152: U1.6 18.15,18.65 18.15,17.89 | 9.55,18.58 U1.23 9.62,17.72 9.85,17.49 10.35,17.49 | 10.35,17.49 10.62,17.76 U1.21 10.62,19.96 11.15,20.49 14.15,20.49 15.05,21.39 C3.1 | U1.15 13.62,17.56 | 13.62,17.56 13.62,16.96 13.25,16.59 12.25,16.59 11.45,17.39 | 11.55,17.39 12.15,17.39 12.12,17.42 U1.18 | 11.55,17.39 11.45,17.39 | 11.45,17.39 11.25,17.39 | 11.25,17.39 10.45,17.39 10.35,17.49 | U1.19 11.62,17.46 11.55,17.39 | 13.62,17.56 13.66,17.6 13.89,17.6 14.12,17.83 U1.14 | C1.1 C2.1 18.75,23.64 R19.1 17.95,24.49 16.8,25.64 v15.5,25.64 | 9.65,23.14 C15.1 10.85,24.19 v10.75,24.29 | 9.65,23.14 C6.1 | U1.2 20.12,16.86 v20.05,16.79 19.65,17.19 18.72,17.19 18.16,17.75 18.16,17.88 18.15,17.89 | v11.75,15.49 11.25,15.99 11.25,17.39 | R6.1 10.05,28.64 v10.05,29.09 | v69.24,49 69.24,50.84 U$2.39 | v62.45,48.99 62.29,48.83 R24.1 62.29,46.33 62.18,46.22 v62.18,46.18 | U$2.34 60.83,52.59 58.11,52.59 U$2.30 56.93,53.67 55.75,52.49 53.11,52.49 U$2.25 50.59,52.49 45.51,52.49 U$2.20 | v69.24,49 69.29,49.05 70.65,47.69 v73.69,47.69 74.39,46.99 v76.05,46.99 76.05,48.31 v76.64,48.9 | v64.75,42.79 64.75,45.79 66.03,47.07 66.84,47.07 | A2.GND 45.85,10.29 44.15,8.59 | 44.15,8.59 v43.05,8.59 | I2S0.1 22.25,5.59 v25.25,8.59 23.35,10.49 18.75,10.49 v18.65,10.39 18.65,10.79 17.55,11.89 | C100.MINUS 72.95,15.64 72.95,12.77 72.95,8.49 72.95,8.37 | GPIO4.GND 27.05,42.49 25.85,41.29 20.65,41.29 20.35,41.59 20.35,43.39 19.98,43.77 | 19.98,43.77 19.95,43.79 18.05,43.79 17.35,43.09 SERIAL.GND 17.35,42.79 14.85,45.29 14.85,46.39 12.85,48.39 4.55,48.39 v4.15,47.99 | v61.15,38.69 61.55,38.29 v61.55,36.79
  Bottom 0.152: PWM0.GND 75.08,32.36 73.65,33.79 66.99,33.79 65.29,35.49 v64.95,35.49 64.75,35.69 v64.75,40.49 | v76.05,42.09 75.05,43.09 v75.05,43.99 | R14.1 41.12,16.31 41.12,17.29 41.47,17.64 44.83,17.64 45.11,17.93 45.11,18.58 45.82,19.29 v45.85,19.29 | v45.85,19.29 46.05,19.29 47.42,17.92 47.42,16.57 R15.1 51.33,15.59 54.03,12.9 | R16.1 53.32,18.97 | 53.32,18.97 v53.32,19 | v44.15,11.09 44.95,11.89 A2.GND | v45.35,13.59 45.85,13.09 A2.GND | R10.1 28.81,8.33 v28.55,8.59 v28.55,10.19 28.55,10.99 29.37,11.81 | 29.37,11.81 A0.GND | v27.95,11.39 28.37,11.81 29.37,11.81 | v40.25,5.89 38.55,4.19 I2S1.1 36.52,3.76 v36.35,3.59 | v54.95,7.09 v57.95,7.09 57.95,8.59 v56.55,9.99 54.55,9.99 54.03,10.51 54.03,12.9 | U1.10 16.12,17.53 16.25,17.4 16.55,17.4 | 16.55,17.4 17.05,17.4 | 17.05,17.4 17.65,17.4 | 17.65,17.4 17.86,17.4 18.15,17.69 18.15,17.89 | U1.9 16.62,17.47 16.55,17.4 | U1.8 17.12,17.47 17.05,17.4 | U1.7 17.62,17.43 17.65,17.4 | v15.65,10.39 17.15,11.89 v17.35,11.89 17.55,11.89 | 17.55,11.89 20.95,11.89 v21.15,11.69 | v1.15,9.19 v1.15,3.99 1.15,3.29 v2.55,1.89 3.35,1.89 v7.25,5.79 v13.05,5.79 12.95,5.69 v12.95,1.39 | v1.75,48.99 2.65,49.89 13.35,49.89 v13.75,49.49 | v44.07,47.1 45.65,45.52 v45.65,44.89 46.23,44.31 v48.07,44.31 | 54.03,12.9 54.03,14.11 v53.65,14.49 | v51.15,8.59 51.95,9.39 v51.95,11.49 52.35,11.89 A3.GND | v47.25,8.59 44.15,8.59 | v45.85,19.29 47.9,19.29 v48,19.19 v50.25,19.19 53.1,19.19 53.32,18.97 | v54.95,27.74 52.4,30.29 v52.4,30.64 54.1,32.34 54.68,32.34 | 54.68,32.34 v54.7,32.34 54.75,32.34 | 54.75,32.34 57.65,32.34 57.88,32.12 | 57.88,32.12 v58,31.99 | v58,31.99 58.55,31.99 59.48,31.06
  Bottom 0.152: 59.48,31.06 v60.9,29.64 60.9,27.64 55,21.74 53.95,21.74 53.5,21.29 v53.5,20.94 | v64.45,49.54 64.7,49.79 65.05,49.79 65.8,50.54 65.8,52.23 v65.54,52.49 | GPIO4.GND 28.25,42.21 v28.25,39.39 | GPIO5.GND 36.15,40.99 v34.55,39.39 | v43.95,39.29 43.95,42.11 GPIO6.GND 44.33,44.61 42.95,45.98 v44.07,47.1 | v36.25,21.85 39.56,25.16 I2C1.GND | v65.5,25.54 64.95,26.09 64.95,28.03 | 64.95,28.03 64.95,30.7 | 64.95,30.7 64.95,34.21 | 64.95,34.21 v64.95,34.24 | v61.5,34.44 59.7,32.64 58.75,32.64 58.1,31.99 v58,31.99 | v7.4,24.34 8.45,24.34 9.65,23.14 | U$2.9 32.3,50.46 R21.1 | v28.85,46.79 29.35,47.29 31.95,47.29 v32.45,46.79 | GPIO4.GND 26.55,43.91 v26.55,45.09 | v23.3,45.19 21.88,43.77 19.98,43.77 | GPIO27.GND 43.95,34.3 v43.95,39.29 | v39.87,39.4 40.85,39.4 | v43.95,39.29 43.85,39.39 40.85,39.39 40.85,39.4 | v42.35,41.29 40.85,39.79 40.85,39.4 | v56.7,36.44 56.7,34.29 56.2,33.79 | 56.2,33.79 56.19,33.77 | 56.19,33.77 54.75,32.34 | v17.74,28.77 18.97,30 v19.71,30 | v24.45,25.08 24.45,26.18 v25.18,26.91 25.18,28.21 v26.3,29.33 v28.22,29.33 | v44.07,47.1 44.09,47.12 44.7,47.12 v45.13,46.69 | v44.07,47.1 44.91,47.94 v45.92,47.94 48.2,47.94 v48.46,47.68 | v55.46,34.26 55.7,34.26 56.19,33.77 | v57.04,33.54 56.44,33.54 56.2,33.79 | v54.92,30.71 54.68,30.95 54.68,32.34 | v57.02,30.74 57.02,31.26 57.88,32.12 | v59.02,30.71 59.37,31.06 59.48,31.06 | v66.02,28.02 64.96,28.02 64.95,28.03 | v66.01,30.6 65.05,30.6 64.95,30.7 | v66.26,33.3 65.86,33.3 64.95,34.21 | 66.84,47.07 C20.2 | v69.24,49 68.32,48.07 67.83,48.07 66.84,47.08 66.84,47.07 | v63.2,4.08 v63.2,5.92 v63.21,5.93 63.32,6.04 v65.42,6.04 66.09,6.71 v66.09,7.34
  Bottom 0.152: v51.61,32.91 52.4,33.7 v52.4,34.74
  Bottom 0.2: 72.95,8.37 72.44,7.86 | 72.44,7.86 72.24,7.66 | v66.09,7.34 67.6,7.34 v68.34,8.08 68.34,8.24 70.21,10.11 70.45,10.11 | 70.45,10.11 v70.39,10.17 70.39,10.29 70.97,10.87 v70.97,12.15 71.78,12.96 v72.22,12.96 | 70.45,10.11 71.65,8.91 v71.65,8.61 | v73.01,7.06 72.44,7.63 72.44,7.86 | v72.99,8.49 72.95,8.49 | v75.37,13.64 74.32,13.64 v73.94,13.26 73.45,12.77 72.95,12.77
  Bottom 0.254: v39.25,19.59 39.25,20.29 v33.15,20.29
  pour Bottom (isolate 0.1, rank 5): -0.15,-0.88 78.59,-0.88 78.59,56.34 -0.15,56.34
  pour Top (isolate 0.1, rank 5): -0.15,-1.08 78.49,-1.08 78.49,56.34 -0.15,56.34
GPIO4  (via drill 0.35)
  Top 0.152: v18.15,47.69 19.65,47.69 v21.4,49.44 | JP1.2 9.15,44.69 9.95,45.49 9.95,47.59 10.35,47.99 15.05,47.99 v15.55,48.49
  Bottom 0.152: v15.55,48.49 17.35,48.49 v18.15,47.69 | U$2.7 28.79,51.23 27.45,49.89 21.85,49.89 v21.4,49.44
GPIO5
  Top 0.152: U2.3 57.48,42.47 56.25,43.69 56.25,50.55 U$2.29
GPIO6
  Top 0.152: U2.4 57.76,43.12 56.77,44.11 56.77,48.53 U$2.31
GPIO12
  Top 0.152: U2.5 57.88,43.77 57.35,44.29 57.35,48.19 58.75,49.59 60.05,49.59 60.75,50.29 60.75,52.59 59.57,53.77 U$2.32
GPIO13
  Top 0.152: U2.6 60.85,44.41 61.35,44.91 61.35,49.49 62.01,50.15 U$2.33
GPIO16/UART1_CTS  (via drill 0.35)
  Top 0.152: U2.7 58.68,45.09 60.35,45.09 60.56,45.3 v60.64,45.3
  Bottom 0.152: U$2.36 63.25,52.47 63.25,46.39 61.95,45.09 60.85,45.09 v60.64,45.3
GPIO17/UART1_RTS  (via drill 0.35)
  Top 0.152: U2.9 58.68,46.39 59.53,46.39 60,46.86 60,48.32 v59.44,48.88 v59.44,48.89
  Bottom 0.152: v59.44,48.89 58.55,49.78 34.31,49.78 34.05,50.04 34.05,51.21 U$2.11
GPIO22  (via drill 0.35)
  Top 0.152: v10,36.29 10,36.11 9.47,35.58 9.47,34.29 v9.9,33.86 | v20.14,36.99 20.92,37.77 26.07,37.77 26.31,38.01 v40.24,38.01 | U$2.15 39.15,49.83 39.84,49.15 41.91,49.15 42.36,48.7 v42.36,47.87
  Bottom 0.152: v10,36.29 6.92,36.29 SPI1.4 | v9.9,33.86 9.9,33.38 10.73,32.55 17.4,32.55 18.11,33.26 18.11,35.48 19.48,36.85 20,36.85 v20.14,36.99 | v40.24,38.01 40.04,38.01 39.15,38.9 39.15,40.35 39.68,40.88 40.92,40.88 43.33,43.29 43.33,44.82 42.25,45.9 42.25,47.76 v42.36,47.87
GPIO24/SPI1_CS0  (via drill 0.35)
  Top 0.152: v16.05,38.69 16.05,38.59 16.65,37.99 18.45,37.99 19.45,38.99 25.35,38.99 25.85,39.49 25.85,39.99 26.75,40.89 28.15,40.89 29,41.74 29,43.89 29.4,44.29 31.15,44.29 32.45,45.59 40.32,45.59 41.03,46.3 42.26,46.3 42.97,47.01 42.97,49.27 42.5,49.74 40.72,49.74 40.43,50.03 40.43,52.01 v40.45,52.03 40.48,52 | v14.65,37.29 13.92,36.56 v11.75,36.56
  Bottom 0.152: U$2.18 40.45,52.53 v40.45,52.03 | v16.05,38.69 v14.65,37.29 | v11.75,36.56 11.5,36.81 10.45,36.81 10.07,37.19 6.95,37.19 5.55,38.59 5.55,39.69 4.25,40.99 SPI1.3
GPIO25/SPI1_MISO  (via drill 0.35)
  Top 0.152: U$2.22 45.49,52.49 43.55,52.49 42.93,51.87 42.93,50.25 43.46,49.72 43.46,46.54 42.77,45.85 41.41,45.85 39.55,43.99 35.25,43.99 34.15,42.89 v34.15,41.49 | v32.25,40.09 27.45,40.09 v26.95,39.59
  Bottom 0.152: v26.95,39.59 26.95,34.69 23.95,31.69 9.45,31.69 8.05,33.09 4.32,33.09 SPI1.7 | v34.15,41.49 32.75,40.09 v32.25,40.09
GPIO26/SPI1_MOSI  (via drill 0.35)
  Top 0.152: v61.45,42.79 61.45,42.59 61.75,42.29 61.75,37.79 60.65,37.79 57.85,40.59 56.65,40.59 55.95,39.89 v55.95,38.99 | 42.51,37.29 v42.45,37.23 53.69,37.23 v54.45,37.99 | v39.35,37.29 21.68,37.29 20.24,35.85 v19.87,35.85
  Bottom 0.152: U$2.37 67.09,51.13 63.85,47.89 63.85,46.29 61.65,44.09 61.65,42.99 v61.45,42.79 | v55.95,38.99 55.75,38.99 54.75,37.99 v54.45,37.99 | v42.45,37.23 42.39,37.29 v39.35,37.29 | SPI1.6 4.5,34.71 7.48,34.71 10.07,32.12 17.84,32.12 18.54,32.82 18.54,35.29 18.97,35.72 19.74,35.72 v19.87,35.85
GPIO27  (via drill 0.35)
  Top 0.152: v60.49,46.26 59.94,45.72 U2.8
  Bottom 0.152: JP4.1 41.52,48.72 54.28,48.72 54.86,48.14 57.64,48.14 57.93,48.43 58.75,48.43 59.14,48.04 59.64,48.04 59.98,48.38 61.27,48.38 61.48,48.17 61.48,46.87 60.89,46.27 v60.5,46.27 v60.49,46.26
GPIO27/SPI1_SCK
  Top 0.152: U$2.13 36.57,51.19 37.73,50.02 37.73,48.71 JP4.2
H_SCL  (via drill 0.35)
  Top 0.152: I2C0.SCL 35.25,24.69 34.75,24.19 32.65,24.19 32.25,24.59 | I2C1.SCL 45.56,27.58 43.55,29.59 33.45,29.59 32.25,28.39 32.25,24.59 | v29.75,21.59 29.25,21.09 29.25,19.42 IC1.6 29.35,19.32 29.35,18.39 29.65,18.09 R8.2 | v30.25,24.29 31.95,24.29 32.25,24.59
  Bottom 0.152: v29.75,21.59 29.75,23.79 v30.25,24.29 | I2C2.SCL 55.85,24.69 54.65,23.49 47.5,23.49 45.56,25.43 I2C1.SCL
H_SDA  (via drill 0.35)
  Top 0.152: I2C0.SDA 33.25,27.59 34.45,28.79 v38.15,28.79 41.75,28.79 43.56,26.98 I2C1.SDA | IC1.5 30.44,19.9 | 30.44,19.9 31.25,20.72 v31.25,20.99 | R8.1 30.44,19.6 30.44,19.9 | v45.95,28.89 46.35,29.29 v50.85,29.29
  Bottom 0.152: v31.25,20.99 32.75,22.49 35.05,22.49 38.35,25.79 38.35,28.59 v38.15,28.79 | I2C1.SDA 43.56,27.4 45.05,28.89 v45.95,28.89 | v50.85,29.29 51.65,29.29 53.86,27.08 I2C2.SDA
I2S0_DIN  (via drill 0.35)
  Top 0.152: I2S0.6 32.15,3.86 32.15,4.89 34.73,7.48 48.47,7.48 v48.85,7.09
  Bottom 0.152: U$2.38 68.35,52.51 68.35,50.09 67.75,49.49 66.95,49.49 64.85,47.39 64.85,46.59 62.35,44.09 62.35,14.15 60.16,11.96 60.16,4.34 59.22,3.4 57.04,3.4 53.15,7.29 49.05,7.29 v48.85,7.09 48.55,6.79 I2S1.6
I2S0_DOUT  (via drill 0.35)
  Top 0.152: U$2.40 70.07,53.77 70.99,52.85 70.99,50.73 70.15,49.89 69.15,49.89 68.15,48.89 68.15,48.19 67.85,47.89 66.25,47.89 65.45,47.09 v65.45,45.39 | I2S0.7 34.08,3.93 34.08,5.48 35.4,6.8 46.83,6.8 v46.88,6.75
  Bottom 0.152: v65.45,45.39 65.45,42.59 63.85,40.99 63.85,40.25 64.17,39.93 64.17,14.35 61.46,11.64 61.46,3.06 59.19,0.79 53.52,0.79 50.64,3.67 | 50.64,3.67 I2S1.7 | v46.88,6.75 47.58,6.06 47.58,2.72 48.13,2.17 49.94,2.17 50.64,2.88 50.64,3.67
I2S0_FS  (via drill 0.35)
  Top 0.152: v44.85,5.19 45.35,5.69 49.85,5.69 53.25,9.09 57.9,9.09 61.8,12.99 62.85,12.99 63.15,13.29 v63.15,14.39 | v63.47,42.29 63.47,43.59 63.11,43.95 63.11,48.48 63.75,49.12 63.75,50.43 U$2.35 | I2S0.4 28.25,2.79 28.65,2.39 36.15,2.39 37.35,3.59 37.35,4.59 37.75,4.99 43.72,4.99 44.55,4.16 I2S1.4
  Bottom 0.152: I2S1.4 44.55,4.89 v44.85,5.19 | v63.15,14.39 63.15,41.97 v63.47,42.29
I2S0_SCLK  (via drill 0.35)
  Top 0.152: v27.65,31.59 28.45,32.39 30.55,32.39 30.85,32.69 30.85,33.41 30.91,33.47 30.91,35.25 31.15,35.49 v31.25,35.49 | v34.29,46.84 33.98,47.15 33.98,48.91 v33.75,49.14
  Bottom 0.152: I2S0.5 30.25,5.09 30.3,5.14 | 30.3,5.14 32.94,7.78 44.13,7.78 46.55,5.37 I2S1.5 | 30.3,5.14 27.25,8.19 27.25,12.09 27.85,12.69 27.85,15.79 23.65,19.99 23.65,28.49 26.75,31.59 v27.65,31.59 | v33.75,49.14 32.8,50.09 32.8,52.5 U$2.12 | 34.34,46.79 v34.29,46.84 34.79,46.34 34.79,44.66 34.8,44.65 34.8,41.04 31.25,37.49 v31.25,35.49
MCLK  (via drill 0.35)
  Top 0.152: I2S0.3 26.25,2.79 27.05,1.99 37.15,1.99 37.35,2.19 v37.35,2.39 | I2S1.3 42.55,3.46 41.68,2.59 v39.55,2.59 | v25.45,10.69 25.05,11.09 25.05,20.21 16.15,29.11 16.15,29.35 v15.57,29.93 | v7.8,31.71 7.8,39.96 7.18,40.58 7.18,46.19 7.68,46.69 JP1.3
  Bottom 0.152: I2S0.3 26.25,9.09 25.45,9.89 v25.45,10.69 | 8.45,46.79 JP1.3 | v37.35,2.39 37.55,2.59 v39.55,2.59 | v15.56,29.92 v15.57,29.93 11.46,29.93 10.84,30.55 8.42,30.55 7.8,31.17 v7.8,31.71
N$2
  Top 0.152: U$9.6 70.48,42.42 72.6,44.54 73.5,44.54 74.35,43.69 74.35,43.39 74.55,43.19 75.95,43.19 77.05,42.09 77.05,38.38 R3.1
N$3  (via drill 0.35)
  Top 0.152: v76.25,38.69 75.65,38.69 75.45,38.49 75.45,37.58 R3.2
  Top 0.2: R3.2 | v71.55,42.49 71.55,41.99 71.05,41.49 71.05,40.01 U$9.7
  Bottom 0.2: v76.25,38.69 76.25,40.89 74.35,42.79 71.85,42.79 v71.55,42.49
N$4
  Top 0.152: U$9.1 67.23,38.07 67.01,37.85 R1.7
N$5  (via drill 0.35)
  Top 0.2: v74.75,38.79 74.61,38.65 R3.3 | v72.05,41.39 71.78,41.12 U$9.8
  Bottom 0.2: v74.75,38.79 74.75,41.39 74.05,42.09 72.75,42.09 v72.05,41.39
N$6
  Top 0.152: U$9.9 72.45,39.91 72.45,39.59 73.81,38.23 R3.4
  Top 0.2: R3.4 73.7,37.54
N$7  (via drill 0.35)
  Top 0.152: U$9.23 70.48,45.26 70.95,44.79 70.95,43.89 70.45,43.39 v70.35,43.39
  Top 0.2: v71.05,38.79 71.65,38.19 R2.6 | 70.55,45.71 U$9.23
  Bottom 0.152: 70.95,40.69 71.05,40.59 v71.05,38.79
  Bottom 0.2: v70.35,43.39 70.35,41.29 70.95,40.69
N$8  (via drill 0.35)
  Top 0.152: U$9.25 69.15,45.81 69.15,46.93 C14.P$2 | U$11.#3 69.18,46.02 U$9.25 | U$9.25 69.18,43.52 v68.85,43.19
  Bottom 0.152: v68.85,43.19 68.6,42.94 R18.2
N$9
  Top 0.152: 33.88,40.22 33.9,40.19 | 53.55,41.09 53.48,41.16 U2.20 52.58,40.69 50.15,40.69 49.35,39.89 44.55,39.89 44.25,40.19 40.65,40.19 40.15,40.69 35.15,40.69 34.68,40.22 33.88,40.22 | GPIO4.I/O 33.1,41.36 33.1,40.84 33.73,40.22 33.88,40.22
N$10
  Top 0.152: R1.6 67.81,39.85 U$9.2
N$11
  Top 0.152: U$9.3 68.53,37.71 R1.5
N$12
  Top 0.152: U$9.4 69.15,39.89 69.15,38.14 69.7,37.59 R2.8
N$13
  Top 0.152: U$7.1 31.65,46.89 31.65,46.34 30.8,45.49 28,45.49 25.15,42.64 23.5,42.64 SERIAL.RX
N$14
  Bottom 0.152: C4.2 7.62,21.07 U1.27
N$15
  Top 0.152: U2.18 52.95,42.57 50.43,42.57 49.25,41.39 47.5,41.39 47.35,41.54 47.35,43.29 46.65,43.99 43.77,43.99 42.27,42.49 GPIO5.I/O
N$16
  Bottom 0.152: 8.05,18.72 U1.26 8.12,20.36 8.45,20.69 8.45,22.34 7.85,22.94 C4.1
N$17
  Top 0.152: GPIO6.I/O 49.45,42.49 50.08,43.12 U2.17
N$18  (via drill 0.35)
  Top 0.152: U2.16 53.88,43.77 54.35,43.29 54.35,40.39 53.75,39.79 52.45,39.79 52.15,39.49 52.15,38.89 51.85,38.59 26.15,38.59 25.81,38.25 20.11,38.25 v19.75,37.89
  Bottom 0.152: v19.75,37.89 18.95,37.09 16.35,37.09 15.55,36.29 GPIO12.I/O
N$19
  Bottom 0.152: U1.28 7.05,18.72 7.05,19.99 6.85,20.19 6.45,20.19 6.15,20.49 C5.1
N$20  (via drill 0.35)
  Top 0.152: v54.35,44.19 54.15,44.19 53.93,44.41 U2.15 | GPIO13.I/O 23.78,32.36 25.65,30.49 v49.85,30.49
  Bottom 0.152: v49.85,30.49 50.49,30.49 53.75,33.75 53.75,43.59 v54.35,44.19
N$21
  Bottom 0.152: U1.29 6.55,18.72 6.55,19.59 6.25,19.89 5.85,19.89 5.15,20.59 5.15,22.39 5.7,22.94 C5.2
N$22  (via drill 0.35)
  Top 0.152: v51.25,43.89 51.55,44.19 51.55,44.89 51.73,45.07 U2.14 | GPIO16.I/O 32.05,33.84 32.05,32.74 33,31.79 v48.45,31.79
  Bottom 0.152: v48.45,31.79 49.11,31.79 51.45,34.13 51.45,34.79 52.15,35.49 52.85,35.49 53.25,35.89 53.25,36.99 51.45,38.79 51.45,43.69 v51.25,43.89
N$23
  Bottom 0.152: U1.5 18.62,21.27 R19.2
N$24
  Bottom 0.152: C2.2 19.15,20.94 19.15,18.68 U1.4
N$25
  Bottom 0.152: C1.2 20.9,21.24 19.62,19.96 U1.3
N$26
  Bottom 0.152: 11.18,18.6 U1.20 11.12,19.56 11.45,19.89 12.65,19.89 | 16.15,22.14 R25.1 16.35,22.09 16.35,21.74 16.35,21.19 16.05,20.89 15.35,20.89 14.35,19.89 12.65,19.89 | 12.65,19.89 12.55,19.79 12.55,18.72 U1.17
N$27
  Bottom 0.152: D1.ANODE 12.87,23.74 R26.1 C3.2 16.25,23.74 R25.2
N$28  (via drill 0.35)
  Top 0.152: U2.10 58.35,47.32 v58.35,47.69
  Bottom 0.152: R24.2 58.56,47.48 v58.35,47.69 58.35,47.39 R23.1 57.35,46.49
N$29
  Top 0.152: U2.13 54.83,45.72 55.25,45.29 55.25,35.69 53.35,33.79 48.46,33.79 GPIO27.I/O
N$30
  Top 0.152: U$7.8 27.85,47.39 25.5,47.39 24.45,48.44 24.15,48.44 21.4,45.69 21.4,42.54 SERIAL.TX
N$31  (via drill 0.35)
  Top 0.152: v45.95,17.69 IC3.3
  Bottom 0.152: R12.2 R15.2 46.7,16.94 v45.95,17.69
N$32  (via drill 0.35)
  Top 0.152: U2.1 56.09,41.16 55.75,41.5 55.75,45.35 55.63,45.47 55.63,48.75 v55.32,49.06 | v24.3,47.59 22.35,45.64 22.35,41.59 | 22.35,41.59 22.35,41.49 | 22.35,41.59 21.75,40.99 v16.55,40.99 | JP1.1 8.55,40.49 10.75,38.29 12.45,38.29 v12.65,38.49
  Bottom 0.152: v55.32,49.06 54.54,49.06 54.31,49.29 35.08,49.29 33.68,47.89 24.6,47.89 v24.3,47.59 | v12.65,38.49 12.95,38.79 13.85,38.79 16.05,40.99 v16.55,40.99
N$33  (via drill 0.35)
  Top 0.152: IC1.7 28.62,20.92 v28.15,21.39 27.98,21.22 IC1.8
  Bottom 0.152: v28.15,21.39 26.9,22.64 R9.1
N$34  (via drill 0.35)
  Top 0.152: v42.25,16.49 42.25,15.79 42.45,15.59 IC3.1
  Bottom 0.152: 31.66,10.08 R4.2 | v42.25,16.49 42.75,16.99 43.75,16.99 44.55,16.19 44.55,12.49 40.31,8.25 32.66,8.25 31.73,9.18 31.73,10.08 31.66,10.08 | R10.2 30.3,10.08 31.66,10.08
N$35
  Bottom 0.152: SERIAL.VCC 19.5,42.34 19.5,41.04 22.14,38.4 JP2.1
N$36  (via drill 0.35)
  Top 0.152: v43.9,18.45 44.68,17.67 IC3.2
  Bottom 0.152: R11.2 38.8,14.29 R14.2 38.8,16.64 40.61,18.45 v43.9,18.45
N$37  (via drill 0.35)
  Top 0.152: LED1.ANODE 70.66,11.37 v70.3,11.37 | v63.66,12.45 63.66,12.55 F1.2
  Top 1.27: F1.2 65.41,14.3 U$10.ANODE
  Bottom 0.152: v70.3,11.37 70.3,11.49 68.06,13.73 64.94,13.73 v63.66,12.45
  pour Top (no thermals): 65.54,12.72 65.54,13.67 67.7,15.83 67.7,20.18 66.62,21.26 64.07,21.26 63.2,20.39 63.2,15.99 64.01,15.18 64.01,12.72
N$38  (via drill 0.35)
  Top 0.152: v48.35,17.69 47.95,17.69 47.22,16.96 IC3.4
  Bottom 0.152: R13.2 R16.2 52.9,17.69 v48.35,17.69
N$40
  Top 0.254: C16.2 35.15,16.34 U7.4
N$41
  Top 1: U$12.K 67.35,23.19 68.65,21.89 72.7,21.89 | 72.7,21.89 C12.1 | C100.PLUS 70.6,19.79 72.7,21.89 | PWM3.VCC 72.53,22.06 72.7,21.89
  Top 1.27: U$10.CATHODE 58.21,20.85 U$12.K
  Top 2: PWM3.VCC PWM2.VCC PWM1.VCC PWM0.VCC
  pour Top (no thermals): 56.74,16.64 59.58,16.64 59.58,19.67 62.2,22.29 67.65,22.29 69.2,20.74 69.2,15.94 69.7,15.44 71.8,15.44 71.95,15.59 71.95,19.64 73.5,21.19 73.5,32.79 73.08,33.21 71.92,33.21 71.4,32.69 71.4,22.99 71.15,22.74 69.05,22.74 67.8,23.99 63.7,23.99 63.5,23.79 59.8,23.79 59.6,23.59 59.6,23.14 58.1,21.64 58.07,21.64 56.74,20.31
  pour Bottom (isolate 0.2, no thermals): 71.39,32.57 72.06,33.24 73.03,33.24 73.63,32.64 73.63,23.4 73.25,23.02 71.87,23.02 71.4,23.49
N$42
  pour Top (isolate 0.5, no thermals): 65.01,11.66 65.53,11.66 66.82,12.95 66.82,13.78 67.27,14.23 68.13,14.23 68.8,13.56 68.8,10.54 67.59,9.33 64.98,9.33
N$43  (via drill 0.35)
  Top 0.152: U$9.5 69.85,39.91 69.85,41.19 v69.45,41.59 | R2.7 70.7,37.74 70.7,38.14 70.1,38.74 v69.9,38.74
  Bottom 0.152: v69.45,41.59 68.95,41.09 SJ5.2 SJ5.3 69.82,35.71 69.82,35.67 69.9,35.75 v69.9,38.74
N$44  (via drill 0.35)
  Top 0.152: v73.55,41.19 73.55,43.11 v72.95,43.71 | U$9.24 69.83,44.71 v69.95,44.59 | R2.5 72.3,37.74 v72.3,38.59
  Bottom 0.152: v69.95,44.59 70.55,44.59 71.43,43.71 v72.95,43.71 | v72.3,38.59 72.95,38.59 73.13,38.41 73.13,36.36 73.56,35.93 SJ2.3 73.61,35.74 74.35,35.74 SJ2.2 74.35,36.74 73.75,37.34 73.75,40.29 73.5,40.54 73.5,41.14 v73.55,41.19
N$45  (via drill 0.35)
  Top 0.152: U$7.6 27.35,48.49 27.15,48.69 27.15,49.24 27,49.39 25.25,49.39 v24.85,48.99
  Bottom 0.152: R17.1 22.9,48.79 23.6,49.49 24.8,49.49 24.85,49.44 v24.85,48.99 25.45,48.39 28.55,48.39 28.6,48.44 30.25,48.44 | 30.35,49.04 R21.2 30.25,48.44 | 30.25,48.44 30.2,48.39
N$46  (via drill 0.35)
  Top 0.152: v12.85,17.19 12.65,17.39 v12.65,26.49
  Bottom 0.152: U1.16 13.12,17.46 v12.85,17.19 | R6.2 11.9,25.74 v12.65,26.49 12.55,26.59 10.35,26.59 10.25,26.49 SJ6.2 | R6.2 11.21,25.7 | SJ6.3 9.09,25.74 R6.2
N$47
  Bottom 0.152: SJ6.1 9.01,27.24 R20.1
N$48  (via drill 0.35)
  Top 0.152: GPIO17.I/O 40.15,36.39 41.55,37.79 52.55,37.79 53.05,38.29 v53.05,38.89 | v50.85,45.29 50.9,45.24 52.02,46.37 U2.12
  Bottom 0.152: v53.05,38.89 53.05,43.29 51.05,45.29 v50.85,45.29
N$49
  Top 1.27: P2.VCC 67.64,11.83 F1.1
N$50
  Top 0.152: U$11.#1 72.19,48.43 R7.P$1 R22.P$2
N$51
  Top 0.152: LED1.CATHODE 73.97,10.28 74.41,10.28 R5.1
N$52  (via drill 0.35)
  Top 0.152: R1.8 66.05,37.79 v66.05,39.19
  Bottom 0.152: v66.05,39.19 66.05,40.34 R18.1
N$53  (via drill 0.35)
  Top 0.152: v30.2,46.39 30.1,46.49 30.1,47.34 29.4,48.04 28,48.04 U$7.7 27.2,47.99 27.1,47.89 26.55,47.89 C19.1
  Bottom 0.152: v30.2,46.39 30.75,45.84 32.8,45.84 33.4,46.44 33.4,47.02 33.95,47.57 34.64,47.57 35.11,47.1 35.11,46.7 35.47,46.34 37.06,46.34 37.33,46.07 JP3.2 37.46,45.28
PWM0
  Top 0.152: PWM0.I/O 70,33.44 70.25,33.69 75.15,33.69 76.21,34.75 R3.8
PWM1
  Top 0.152: PWM1.I/O 68.77,29.37 67.85,30.29 67.85,33.79 68.15,34.09 74.85,34.09 75.41,34.65 R3.7
PWM2
  Top 0.152: PWM2.I/O 68.31,26.83 67.45,27.69 67.45,34.19 67.75,34.49 74.25,34.49 74.61,34.85 R3.6
PWM3
  Top 0.152: PWM3.I/O 69.89,24.21 68.75,24.21 67.05,25.91 67.05,34.59 67.35,34.89 73.55,34.89 73.81,35.15 R3.5
RX
  Top 0.152: U$2.10 30.25,52.49 30.25,49.89 30.15,49.79 30.15,49.14 30.3,48.99 U$7.4
SCL  (via drill 0.35)
  Top 0.152: 65.85,49.99 65.82,49.97 | 65.82,49.97 63.85,47.99 63.85,44.79 65.05,43.59 67.85,43.59 68.55,44.29 68.55,45.76 U$9.26 | v18.05,20.29 v18.05,16.79 | 26.48,14.19 v26.45,14.19 28.95,14.19 29.27,14.52 IC1.3 29.27,17.12 29.55,17.39 31.05,17.39 R8.3 | v16.25,44.99 19.71,44.99 25.95,51.23 U$2.5 26.45,51.53 27.15,52.23 27.15,52.26 27.77,52.88 27.77,54.73 28.13,55.09 65.35,55.09 65.85,54.59 65.85,53.14 66.35,52.64 66.35,52.34 65.82,51.82 65.82,49.97
  Bottom 0.152: v16.25,44.99 16.25,45.79 12.95,49.09 3.25,49.09 1.85,47.69 1.85,30.49 2.75,29.59 2.75,28.59 2.5,28.34 2.5,14.84 | 2.45,14.89 2.5,14.84 | 2.5,14.84 5.15,12.19 13.35,12.19 14.62,13.46 U1.13 14.62,19.46 15.55,20.39 17.95,20.39 v18.05,20.29 | v18.05,16.79 20.65,14.19 v26.45,14.19
SDA  (via drill 0.35)
  Top 0.152: v17.05,46.19 19.25,46.19 23.91,50.85 U$2.3 25.15,52.47 25.15,54.69 26.05,55.59 67.19,55.59 68.41,54.37 68.41,50.55 67.65,49.79 66.45,49.79 64.45,47.79 64.45,45.29 65.35,44.39 67.25,44.39 67.88,45.02 U$9.27 | IC1.4 29.93,15.79 | 29.93,15.79 29.93,13.57 29.35,12.99 v26.45,12.99 | R8.4 30.45,15.79 29.93,15.79
  Bottom 0.152: v26.45,12.99 19.85,12.99 | 19.85,12.99 15.75,12.99 13.05,10.29 3.15,10.29 0.85,12.59 0.85,49.59 1.85,50.59 13.68,50.59 14.55,49.72 14.55,48.39 16.75,46.19 v17.05,46.19 | U1.12 15.12,17.22 15.25,17.09 15.55,17.09 | 15.55,17.09 15.62,17.16 U1.11 | 15.55,17.09 16.45,17.09 19.85,13.69 19.85,12.99
SPI0_CS0  (via drill 0.35)
  Top 0.152: IC3.10 51.02,22.07 51.35,22.39 57.48,22.39 59.6,24.52 62.88,24.52 64.25,25.89 64.25,30.49 60.6,34.14 v60.6,35.79 | v49.57,47.84 48.05,49.36 48.05,52.51 U$2.24
  Bottom 0.152: v60.6,35.79 60.55,35.84 60.55,41.69 54.35,47.89 49.62,47.89 v49.57,47.84
SPI0_MISO  (via drill 0.35)
  Top 0.152: U$2.21 46.77,49.91 46.75,49.89 46.75,48.99 47.65,48.09 47.65,45.99 v47.35,45.69 | IC3.12 48.48,22.43 49.45,23.39 56.85,23.39 59.15,25.69 62.15,25.69 62.95,26.49 62.95,30.29 58.55,34.69 v58.55,38.69
  Bottom 0.152: v47.35,45.69 48.11,46.45 54.48,46.45 58.55,42.38 v58.55,38.69
SPI0_MOSI  (via drill 0.35)
  Top 0.152: IC3.11 49.76,22.3 50.35,22.89 57.25,22.89 59.45,25.09 62.55,25.09 63.65,26.19 63.65,30.39 59.65,34.39 v59.65,36.89 | v46.65,46.99 45.85,46.99 44.23,48.61 U$2.19
  Bottom 0.152: v59.65,36.89 59.65,41.99 54.75,46.89 46.75,46.89 v46.65,46.99
SPI0_SCLK  (via drill 0.35)
  Top 0.152: IC3.13 47.22,22.46 48.65,23.89 56.55,23.89 58.95,26.29 61.95,26.29 62.45,26.79 62.45,29.99 57.55,34.89 v57.55,39.69 | v49.05,45.49 49.05,46.19 50.45,47.59 50.45,50.09 U$2.23
  Bottom 0.152: v57.55,39.69 57.55,42.49 54.09,45.95 50.42,45.95 49.96,45.49 v49.05,45.49
SPI1_SCLK  (via drill 0.35)
  Top 0.152: v10.39,35.43 13.64,35.43 14.16,35.95 v14.49,35.95 | v17.48,38.55 18.54,39.61 23.79,39.61 26.53,42.35 26.53,42.96 28.47,44.9 31.2,44.9 32.42,46.12 35.65,46.12 36.62,47.09 JP4.3
  Bottom 0.152: SPI1.5 5.24,36.99 6.8,35.43 v10.39,35.43 | v14.49,35.95 17.09,38.55 v17.48,38.55
TX
  Top 0.152: U$2.8 28.99,53.17 27.75,51.93 27.75,50.34 28.4,49.69 28.4,49.29 28.1,48.99 U$7.5

## Text on the board
tPlace: Designed in Aizu | I2S | SPI | MCLK | 1 | CLK | G27 | G4 | PWM | PWM | OUTIN | EIAJ2 | DC6V,5.9V | #519 | REV 1.0.14
bPlace: 5V | SERIAL | 3V3 | GPIO LEVEL | SERIAL POWER OUTPUT | 5V | 33V | PCA9685 ADDRESS | F-519-1-14-A-N-J-0-P | OLED ADRESS | S/N